# EasyEDA Pro project ProPrj_MambaQuad_2026-04-23.epro, board FC V1.1
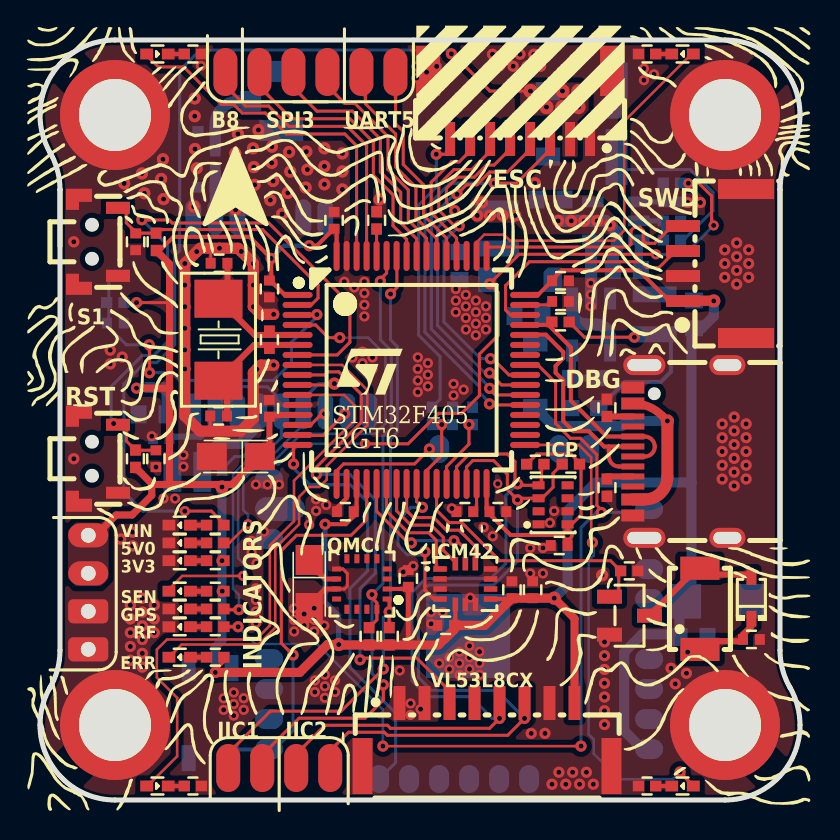
[diagram p18: board, top side]
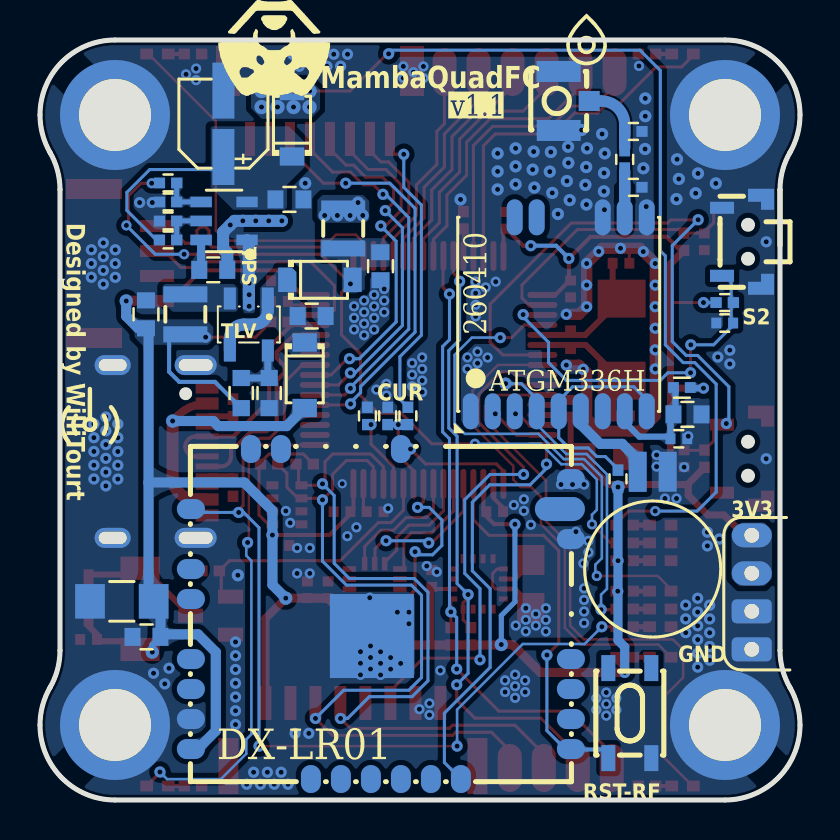
[diagram p19: board, bottom side, seen from below]

Outline 38 x 38 mm; copper layers: Top Layer, Bottom Layer. Coordinates in mm from the lower left corner of the outline.
Outline path: 1,30.52 arc(0.87,31.48) 0.5,32.38 arc(0.13,33.28) 0,34.25 arc(1.1,36.9) 3.75,38 34.25,38 arc(36.9,36.9) 38,34.25 arc(37.87,33.28) 37.5,32.38 arc(37.13,31.48) 37,30.52 37,7.48 arc(37.13,6.52) 37.5,5.62 arc(37.87,4.72) 38,3.75 arc(36.9,1.1) 34.25,0 3.75,0 arc(1.1,1.1) 0,3.75 arc(0.13,4.72) 0.5,5.62 arc(0.87,6.52) 1,7.48 1,30.52 ; 1,30.52 1,27.71
Stack: Top Layer 0.035mm / Dielectric1 1.51mm FR4 er 4.5 / Bottom Layer 0.035mm

## Design rules (mm)
net SWCLK: DP2
net SWDIO: DP2
net USB_DEBUG_DP: DP1
net USB_DEBUG_DM: DP1
spacing copperThickness1oz (default): track to track 0.102, other pairs 0.152 to 0.3
spacing copperThickness2oz: track to track 0.203, other pairs 0.152 to 0.3
spacing safeClearance1: track to track 0.152, other pairs 0.114 to 0.3
track width copperThickness1oz (default): min 0.102, default 0.203, max 2.54
track width copperThickness2oz: min 0.203, default 0.254, max 2.54
differential pair differentialPair (default): width min 0.127, default 0.254, max 2.54; gap min 0.152, default 0.152
pour e1762 uses copperRegion, safeClearance1

## Placement (name value [footprint] x y rotation side)
3V3  -  [LED0402]  6.99 11.97 0 top
5V0  -  [LED0402]  6.99 12.85 0 top
ANT  3GHz  [ANT-SMD_3P-L3.0-W2.6]  11.3 34.95 270 bottom
ATGM336H  ATGM336H-6N-74  [COMM-SMD_18P-L10.1-W9.7-P1.1-TL_L76-LB]  12.06 24.28 90 bottom
BUZ  DET402  [BUZ-SMD_L4.0-W3.0-LS4.5-FD]  33 9.56 90 top
C1  100nF  [C0402]  18.41 11.08 270 top
C2  4.7uF  [CASE-A_3216]  13.46 10.8 270 top
C3  2.2uF  [C0402]  24.63 10.51 270 top
C4  100nF  [C0402]  23.6 10.51 270 top
C5  100nF  [C0603]  32.67 8.16 180 bottom
C6  1uF  [C0402]  5.79 17.06 270 top
C7  100nF  [C0402]  14.7 28.98 270 top
C8  100nF  [C0402]  11.47 25.55 90 top
C9  100nF  [C0402]  26.03 25.96 180 top
C10  100nF  [C0402]  15.27 14.42 0 top
C11  100nF  [C0402]  22.9 14.42 180 top
C12  22pF  [C0402]  8.93 19.2 180 top
C13  22pF  [C0402]  8.95 26.84 180 top
C14  1uF  [CASE-A_3216]  9.79 17.17 180 top
C15  100nF  [C0402]  11.47 19.58 270 top
C16  2.2uF  [C0402]  26.03 24.93 180 top
C17  2.2uF  [C0402]  21.24 14.42 0 top
C18  100nF  [C0402]  25.96 12.73 0 top
C19  100uF  [C1206]  33.91 9.93 180 bottom
C21  100nF  [C0603]  25.53 30.03 0 bottom
C22  22uF  [C0603]  20.98 26.69 90 bottom
C23  100nF  [C0603]  29.34 26.51 180 bottom
C24  10uF  [CAP-SMD_BD4.0-L4.3-W4.3-LS5.0-FD]  28.83 33.81 90 bottom
C25  4.7uF  [C0603]  24.42 24.2 0 bottom
C26  10uF  [C0603]  32.7 24.28 270 bottom
C27  1uF  [C0402]  4.78 27.91 270 top
C28  1uF  [C0402]  3.76 23.85 0 bottom
C29  100nF  [C0402]  35.57 8.03 180 top
C30  10uF  [C0603]  5.63 19.28 0 bottom
C31  0.22F  [CAP-TH_DMS3R3224]  7.37 16.41 90 bottom
C32  100nF  [C0402]  6.06 18.06 0 bottom
C33  10nF  [C0402]  20.29 8.73 0 top
D1  1N5819W  [SOD-123_L2.7-W1.6-LS3.7-RD]  25.4 33.81 90 bottom
D2  1N5819W  [SOD-123_L2.7-W1.6-LS3.7-RD]  24.76 21.24 270 bottom
D3  1N5819W  [SOD-123_L2.7-W1.6-LS3.7-RD#2]  24 26.01 180 bottom
D4  1N4148WS  [SOD-323_L1.7-W1.3-LS2.5-FD]  35.57 10.11 270 top
DBG  Type-C-TOP_1  [USB-C-SMD_TYPE-C16PIN]  32 17.43 90 top
DX-LR01  DX-LR01-433T22S  [WIRELM-SMD_DX-LR01-433T22S]  20.96 9.3 270 bottom
ERR  -  [LED0402]  6.99 7.14 0 top
ESC  WAFER-SH1.0-8PWB  [CONN-SMD_8P-P1.00_XUNPU_WAFER-SH1.0-8PWB]  24 34.75 180 top
GPS  -  [LED0402]  6.99 9.55 0 top
H2  -  [HDR-TH_6P-P2.54-V-F]  15.62 36.4 0 top
H4  -  [HDR-TH_4P-P2.54-V-F]  2.41 9.42 270 top
ICM42  ICM-42688-P  [LGA-14_L3.0-W2.5-P0.50-TL]  21.27 10.8 0 top
ICP  ICP-10111  [LGA-8_L2.5-W2.0-P0.65_AMP6127]  25.65 14.76 180 top
L1  4.7uH  [IND-SMD_L2.5-W2.0_MHCHL2520]  22.84 28.58 270 bottom
L2  2.2uH  [IND-SMD_L2.5-W2.0_MHCHL2520]  30.73 24.28 270 bottom
L3  BLM15PX121SN1D  [L0402]  5.91 20.62 180 bottom
LF  -  [LED0402]  5.87 37.3 180 top
LR  -  [LED0402]  5.87 0.7 180 top
NOREF  -  [Pad_e3]  34.25 3.75 270 top
NOREF#2  -  [Pad_e2]  34.25 34.25 0 top
NOREF#3  -  [HDR-TH_4P-P2.54-V-F#2]  13.22 1.6 0 top
NOREF#4  -  [Pad_e4]  3.75 3.75 180 top
NOREF#5  -  [Pad_e1]  3.75 34.25 0 top
Q1  AO3400  [SOT-23-3_L2.9-W1.3-P1.90-LS2.4-BL-2]  29.47 9.22 270 top
QMC  QMC5883P  [LGA-16_L3.0-W3.0-P0.50-BL_SQ]  16.09 10.8 90 top
R1  4.7K  [R0402]  16.45 8.19 270 top
R5  10K  [R0402]  17.47 8.19 270 top
R6  10K  [R0402]  21.63 19.2 90 bottom
R7  5.1K  [R0402]  28.35 19.61 90 top
R8  10K  [R0402]  4.77 17.06 270 top
R9  1M  [R0402]  11.47 23.01 270 top
R10  4.7K  [R0402]  26.54 16.79 0 top
R11  4.7K  [R0402]  24.76 16.79 180 top
R12  220K  [R0402]  31.6 30.85 180 bottom
R13  30K  [R0402]  31.6 29.9 0 bottom
R14  100K  [R0603]  26.54 20.35 90 bottom
R15  4.7K  [R0402]  8.76 13.74 180 top
R16  453K  [R0603]  27.94 20.35 270 bottom
R17  1.5K  [R0402]  8.76 12.85 0 top
R18  1K  [R0402]  8.76 11.97 180 top
R19  1.5K  [R0402]  26.03 23.9 180 top
R20  UNKNOWN  [R0402]  19.6 19.2 270 bottom
R21  UNKNOWN  [R0402]  20.62 19.2 90 bottom
R22  330Ω  [R0402]  8.76 8.66 180 top
R23  200Ω  [R0402]  30.35 0.7 180 top
R24  200Ω  [R0402]  30.35 37.3 180 top
R25  330Ω  [R0402]  7.65 0.7 0 top
R26  330Ω  [R0402]  7.65 37.3 0 top
R27  330Ω  [R0402]  8.76 7.14 0 top
R28  330Ω  [R0402]  8.76 10.44 0 top
R29  10K  [R0402]  5.81 27.91 90 top
R30  10K  [R0402]  3.76 24.87 180 bottom
R31  10K  [R0402]  29.46 11.46 0 top
R32  453K  [R0402]  31.6 28 180 bottom
R33  0Ω  [R0402]  8.76 32.03 270 bottom
R34  0Ω  [R0402]  8.33 30.63 0 bottom
R35  10K  [R0402]  16.83 28.98 90 top
R36  0Ω  [R0402]  9.1 16.06 270 bottom
R37  200Ω  [R0402]  8.76 9.55 180 top
R38  5.1K  [R0402]  28.35 15.62 90 top
R39  100K  [R0402]  31.6 28.95 0 bottom
R40  0Ω  [R0402]  8.33 33.43 0 bottom
RF  -  [LED0402]  6.99 8.66 0 top
RF#2  -  [LED0402]  32.13 37.3 0 top
RR  -  [LED0402]  32.13 0.7 0 top
RST  HX TS24CA-H3.8 160gf  [SW-SMD_TS24CA]  2.92 17.06 90 top
RST-RF  K2-1808SN-A3SW-01  [SW-SMD_4P-L4.2-W3.3-P2.15-LS5.1]  8.51 4.34 270 bottom
S1  HX TS24CA-H3.8 160gf  [SW-SMD_TS24CA]  2.92 27.91 90 top
S2  HX TS24CA-H3.8 160gf  [SW-SMD_TS24CA]  2.92 27.91 270 bottom
SEN  -  [LED0402]  6.99 10.44 0 top
STM32F405  STM32F405RGT6  [LQFP-64_L10.0-W10.0-P0.50-LS12.0-BL]  18.57 21.5 270 top
SWD  WAFER-GH1.25-4PWB  [CONN-SMD_4P-P1.25_XUNPU_WAFER-GH1.25-4PWB]  33.73 26.82 90 top
TLV  TLV62568DBVR  [SOT-23-5_L3.0-W1.7-P0.95-LS2.8-BR]  27.56 23.78 90 bottom
TPS  TPS54202DDCR  [SOT-23-6_L2.9-W1.6-P0.95-LS2.8-BL]  28.8 28.95 90 bottom
VIN  -  [LED0402]  6.99 13.74 0 top
VL53L8CX  WAFER-GH1.25-8PWB  [CONN-SMD_8P-P1.25_XUNPU-WAFER-GH1.25-8PWB]  22.35 3.27 0 top
X1  8MHz  [CRYSTAL-SMD_L5.0-W3.2]  8.92 23.01 90 top

## Footprints (pads in the part's own frame, mm; a bottom-side part is the same pattern mirrored in y, then rotated)
ANT-SMD_3P-L3.0-W2.6
  rect 1x1.05 smd: 1(0,0.762)
  rect 1.05x2.2 smd: 2(-1.475,-0.762) 3(1.475,-0.762)
BUZ-SMD_L4.0-W3.0-LS4.5-FD
  rect 1.16x1.96 smd: 1(-2.03,0) 2(2.03,0)
C0402
  rect 0.5x0.54 smd: 1(-0.42,0) 2(0.42,0)
C0603
  rect 0.8x0.9 smd: 1(-0.7,0) 2(0.7,0)
C1206
  rect 1.485x1.728 smd: 1(-1.593,0) 2(1.593,0)
CAP-SMD_BD4.0-L4.3-W4.3-LS5.0-FD
  rect 2.8x1.1 smd: 1(-1.661,0) 2(1.661,0)
CAP-TH_DMS3R3224
  rect 2x0.9 smd: 1(-0.002,0.75) 2(0.002,-0.75)
CASE-A_3216
  rect 1.5x1.359 smd: 1(-1.2,0) 2(1.2,0)
COMM-SMD_18P-L10.1-W9.7-P1.1-TL_L76-LB
  custom 1.8x0.8 smd: 1(-4.85,4.4) 2(-4.85,3.3) 3(-4.85,2.2) 4(-4.85,1.1) 5(-4.85,0) 6(-4.85,-1.1) 7(-4.85,-2.2) 8(-4.85,-3.3) 9(-4.85,-4.4) 10(4.85,-4.4) 11(4.85,-3.3) 12(4.85,-2.2) 15(4.85,1.1) 16(4.85,2.2)
CONN-SMD_4P-P1.25_XUNPU_WAFER-GH1.25-4PWB
  rect 0.6x1.7 smd: 1(-1.875,1.575) 2(-0.625,1.575) 3(0.625,1.575) 4(1.875,1.575)
  rect 1x2.8 smd: 5(3.725,-1.575) 6(-3.725,-1.575)
CONN-SMD_8P-P1.00_XUNPU_WAFER-SH1.0-8PWB
  rect 0.5x1.7 smd: 1(-3.5,1.7) 2(-2.5,1.7) 3(-1.5,1.7) 4(-0.5,1.7) 5(0.5,1.7) 6(1.5,1.7) 7(2.5,1.7) 8(3.5,1.7)
  rect 1.2x2.5 smd: 9(4.6,-1.7) 10(-4.6,-1.7)
CONN-SMD_8P-P1.25_XUNPU-WAFER-GH1.25-8PWB
  rect 0.6x1.7 smd: 1(-4.375,1.575) 2(-3.126,1.575) 3(-1.875,1.575) 4(-0.625,1.575) 5(0.625,1.575) 6(1.875,1.575) 7(3.125,1.575) 8(4.375,1.575)
  rect 1x2.8 smd: 10(6.225,-1.575) 11(-6.225,-1.575)
CRYSTAL-SMD_L5.0-W3.2
  rect 1.9x2.4 smd: 1(-2.05,0) 2(2.05,0)
HDR-TH_4P-P2.54-V-F
  oval 1.2x2 hole 0.74: 1(-3.81,0) 2(-1.91,0)
  rrect 1.2x2 hole 0.74: 3(-0.01,0) 4(1.89,0)
HDR-TH_4P-P2.54-V-F#2
  oval 1.2x2.4 smd: 1(-3.81,0) 2(-2.11,0) 3(-0.41,0) 4(1.29,0)
HDR-TH_6P-P2.54-V-F
  oval 1.2x2.4 smd: 1(-6.35,0) 2(-4.65,0) 3(-2.95,0) 4(-1.25,0) 5(0.45,0) 6(2.15,0)
IND-SMD_L2.5-W2.0_MHCHL2520
  rect 0.8x2.2 smd: 1(-1,0) 2(1,0)
L0402
  rect 0.54x0.54 smd: 1(-0.42,0) 2(0.42,0)
LED0402
  rect 0.637x0.541 smd: 1(-0.538,0) 2(0.538,0)
LGA-8_L2.5-W2.0-P0.65_AMP6127
  rect 0.6x0.4 smd: 1(0.725,0.975) 2(0.725,0.325) 3(0.725,-0.325) 4(0.725,-0.975) 5(-0.725,-0.975) 6(-0.725,-0.325) 7(-0.725,0.325) 8(-0.725,0.975)
LGA-14_L3.0-W2.5-P0.50-TL
  rect 0.675x0.28 smd: 1(-1.262,0.75) 2(-1.262,0.25) 3(-1.262,-0.25) 4(-1.262,-0.75) 8(1.262,-0.75) 9(1.262,-0.25) 10(1.262,0.25) 11(1.262,0.75)
  rect 0.28x0.675 smd: 5(-0.5,-1.012) 6(0,-1.012) 7(0.5,-1.012) 12(0.5,1.012) 13(0,1.012) 14(-0.5,1.012)
LGA-16_L3.0-W3.0-P0.50-BL_SQ
  rect 0.25x0.45 smd: 1(-0.75,-1.263) 2(-0.25,-1.263) 3(0.25,-1.263) 4(0.75,-1.263) 9(0.75,1.263) 10(0.25,1.263) 11(-0.25,1.263) 12(-0.75,1.263)
  rect 0.45x0.25 smd: 5(1.263,-0.75) 6(1.263,-0.25) 7(1.263,0.25) 8(1.263,0.75) 13(-1.263,0.75) 14(-1.263,0.25) 15(-1.263,-0.25) 16(-1.263,-0.75)
LQFP-64_L10.0-W10.0-P0.50-LS12.0-BL
  oval 0.3x1.5 smd: 1(-3.75,-5.688) 2(-3.25,-5.688) 3(-2.75,-5.688) 4(-2.25,-5.688) 5(-1.75,-5.688) 6(-1.25,-5.688) 7(-0.75,-5.688) 8(-0.25,-5.688) 9(0.25,-5.688) 10(0.75,-5.688) 11(1.25,-5.688) 12(1.75,-5.688) 13(2.25,-5.688) 14(2.75,-5.688) 15(3.25,-5.688) 16(3.75,-5.688) 33(3.75,5.688) 34(3.25,5.688) 35(2.75,5.688) 36(2.25,5.688) 37(1.75,5.688) 38(1.25,5.688) 39(0.75,5.688) 40(0.25,5.688) 41(-0.25,5.688) 42(-0.75,5.688) 43(-1.25,5.688) 44(-1.75,5.688) 45(-2.25,5.688) 46(-2.75,5.688) 47(-3.25,5.688) 48(-3.75,5.688)
  oval 1.5x0.3 smd: 17(5.7,-3.738) 18(5.7,-3.238) 19(5.7,-2.738) 20(5.7,-2.238) 21(5.7,-1.738) 22(5.7,-1.238) 23(5.7,-0.739) 24(5.7,-0.238) 25(5.7,0.262) 26(5.7,0.762) 27(5.7,1.262) 28(5.7,1.762) 29(5.7,2.261) 30(5.7,2.762) 31(5.7,3.261) 32(5.7,3.762) 49(-5.7,3.762) 50(-5.7,3.261) 51(-5.7,2.762) 52(-5.7,2.261) 53(-5.7,1.762) 54(-5.7,1.262) 55(-5.7,0.762) 56(-5.7,0.262) 57(-5.7,-0.238) 58(-5.7,-0.739) 59(-5.7,-1.238) 60(-5.7,-1.738) 61(-5.7,-2.238) 62(-5.7,-2.738) 63(-5.7,-3.238) 64(-5.7,-3.738)
Pad_e1
  round 5.5 hole 3.6: 1(0,0)
Pad_e2
  round 5.5 hole 3.6: 1(0,0)
Pad_e3
  round 5.5 hole 3.6: 1(0,0)
Pad_e4
  round 5.5 hole 3.6: 1(0,0)
R0402
  rect 0.566x0.54 smd: 1(-0.433,0) 2(0.433,0)
R0603
  rect 0.806x0.864 smd: 1(-0.753,0) 2(0.753,0)
SOD-123_L2.7-W1.6-LS3.7-RD
  rect 0.91x1.22 smd: 1(-1.635,0) 2(1.635,0)
SOD-123_L2.7-W1.6-LS3.7-RD#2
  custom 0.91x1.22 smd: 1(-1.635,0)
  rect 0.91x1.22 smd: 2(1.635,0)
SOD-323_L1.7-W1.3-LS2.5-FD
  rect 0.78x0.5 smd: 1(-1.04,0) 2(1.04,0)
SOT-23-3_L2.9-W1.3-P1.90-LS2.4-BL-2
  rect 0.7x1.25 smd: 1(-0.95,-1) 2(0.95,-1) 3(0,1)
SOT-23-5_L3.0-W1.7-P0.95-LS2.8-BR
  rect 1.1x0.6 smd: 1(1.3,-0.95) 2(1.3,0) 3(1.3,0.95) 4(-1.3,0.95) 5(-1.3,-0.95)
SOT-23-6_L2.9-W1.6-P0.95-LS2.8-BL
  rect 0.532x1.072 smd: 1(-0.95,-1.149) 2(0,-1.149) 3(0.95,-1.149) 4(0.95,1.149) 5(0,1.149) 6(-0.95,1.149)
SW-SMD_4P-L4.2-W3.3-P2.15-LS5.1
  rect 1.3x0.7 smd: 1(-2.25,1.075) 2(2.25,1.075) 3(-2.25,-1.075) 4(2.25,-1.075)
SW-SMD_TS24CA
  custom 1.05x1.3 smd: 1(-2.125,0.975) 2(2.125,0.975)
  rect 0.6x1.2 smd: 3(-1.7,-0.975) 4(1.7,-0.975)
USB-C-SMD_TYPE-C16PIN
  oval 1x2.1 hole 0.6x1.7: 1(-4.32,1.788) 2(4.32,1.788)
  oval 1x1.8 hole 0.6x1.4: 3(-4.32,-2.362) 4(4.32,-2.362)
  rect 0.6x1.15 smd: A1B12(-3.2,2.362) A4B9(-2.4,2.362) B1A12(3.2,2.362) B4A9(2.4,2.362)
  rect 0.3x1.15 smd: A5(-1.25,2.362) A6(-0.25,2.362) A7(0.25,2.362) A8(1.25,2.362) B5(1.75,2.362) B6(0.75,2.362) B7(-0.75,2.362) B8(-1.75,2.362)
WIRELM-SMD_DX-LR01-433T22S
  oval 1.4x1 smd: 2(-8.25,1) 6(-8.25,-5) 7(-8.25,-6.5) 16(8.25,-3.5) 17(8.25,-2) 18(8.25,-0.5) 19(8.25,1) 20(8.25,2.5) 21(8.25,4)
  oval 1x1.4 smd: 8(-5.25,-9.5) 10(-2.25,-9.5) 11(-0.75,-9.5) 12(2.25,-9.5) 13(3.75,-9.5) 14(5.25,-9.5) 15(6.75,-9.5) 22(6.75,9.5) 23(5.25,9.5) 24(3.75,9.5) 25(2.25,9.5) 28(-3.75,9.5) 30(-6.75,9.5)
  oval 1.2x2.5 smd: 29(-5.25,8.95)
  rect 4.2x4.2 smd: 31(1.1,-0.45)

## Nets
3V3: BUZ.1 C1.2 C3.2 C4.2 C5.2 C7.2 C8.2 C9.2 C10.2 C11.2 C14.1 C15.2 C18.2 C19.2 C26.2 C29.2 C33.2 D4.2 DX-LR01.15 H4.1 H4.2 ICM42.5 ICM42.8 ICP.8 L2.2 L3.2 QMC.2 R1.2 R5.2 R8.2 R10.2 R11.2 R16.2 R18.1 R19.1 R27.2 R28.2 R29.1 R30.1 R36.2 STM32F405.1 STM32F405.13 STM32F405.19 STM32F405.32 STM32F405.48 STM32F405.64 SWD.1 VL53L8CX.8
5V_TPS: C22.2 D3.2 L1.2 R12.1 R17.2
5V_USB: D2.2 DBG.A4B9 DBG.B4A9
GND: 3V3.1 5V0.1 ANT.2 ANT.3 ATGM336H.1 ATGM336H.10 ATGM336H.12 C1.1 C2.2 C3.1 C4.1 C5.1 C6.2 C7.1 C8.1 C9.1 C10.1 C11.1 C12.2 C13.2 C14.2 C15.1 C16.1 C17.1 C18.1 C19.1 C21.1 C22.1 C24.2 C25.1 C26.1 C27.2 C28.2 C29.1 C30.1 C31.2 C32.1 C33.1 DBG.1 DBG.2 DBG.3 DBG.4 DBG.A1B12 DBG.B1A12 DX-LR01.14 DX-LR01.28 DX-LR01.30 DX-LR01.31 ESC.1 ESC.9 ESC.10 GPS.1 H4.3 H4.4 ICM42.2 ICM42.3 ICM42.6 ICM42.7 ICM42.10 ICM42.11 ICP.1 ICP.7 NOREF.1 NOREF#2.1 NOREF#4.1 NOREF#5.1 Q1.2 QMC.9 QMC.11 R6.2 R7.2 R13.2 R14.1 R21.2 R23.2 R24.2 R25.2 R26.2 R31.2 R34.1 R35.2 R38.1 R39.2 R40.1 RF.1 RST.1 RST.2 RST.3 RST-RF.2 S1.1 S1.2 S1.3 S2.1 S2.2 S2.3 STM32F405.12 STM32F405.18 STM32F405.63 SWD.2 SWD.5 SWD.6 TLV.2 TPS.1 VIN.1 VL53L8CX.1 VL53L8CX.2 VL53L8CX.7 VL53L8CX.10 VL53L8CX.11
VIN: D1.2 ESC.2 R15.1
ADC1_IN8: R20.2 R21.1 STM32F405.26
BUZ: Q1.1 R31.1 STM32F405.27
DSHOT_M1: ESC.3 STM32F405.37
DSHOT_M2: ESC.4 STM32F405.38
DSHOT_M3: ESC.5 STM32F405.39
DSHOT_M4: ESC.6 STM32F405.40
ESC_CURR: ESC.8 R20.1
ESC_TX: ESC.7 STM32F405.52
EX_PB8: H2.1 STM32F405.61
EX_SPI3_MISO: H2.3 STM32F405.56
EX_SPI3_MOSI: H2.2 STM32F405.57
EX_SPI3_SCK: H2.4 STM32F405.55
EX_UART5_RX: H2.5 STM32F405.54
EX_UART5_TX: H2.6 STM32F405.53
GPIO_EXTI2: ATGM336H.4 R37.1 STM32F405.10
GPIO_EXTI5: ICM42.4 STM32F405.25
GPIO_EXTI8: DX-LR01.8 R22.1 STM32F405.41
GPIO_EXTI13: C27.1 R29.2 S1.4 STM32F405.2
GPIO_EXTI14: C28.1 R30.2 S2.4 STM32F405.3
GPS_RX: ATGM336H.3 STM32F405.14
GPS_TX: ATGM336H.2 STM32F405.15
I2C1_SCL: NOREF#3.1 QMC.1 R5.1 STM32F405.58
I2C1_SDA: NOREF#3.2 QMC.16 R1.1 STM32F405.59
I2C2_SCL: ICP.4 NOREF#3.3 R11.1 STM32F405.29 VL53L8CX.5
I2C2_SDA: ICP.3 NOREF#3.4 R10.1 STM32F405.30 VL53L8CX.6
ICM42688P_CS: ICM42.12 STM32F405.24
ICM42688P_SCK: ICM42.13 STM32F405.21
ICM42688P_SDI: ICM42.14 STM32F405.23
ICM42688P_SDO: ICM42.1 STM32F405.22
LED_ERR: ERR.1 STM32F405.8
LED_LF: LF.2 STM32F405.62
LED_LR: LR.2 STM32F405.11
LED_RF: RF#2.2 STM32F405.50
LED_RR: RR.2 STM32F405.33
LED_SENS: SEN.1 STM32F405.4
LORA_RST: DX-LR01.22 RST-RF.4 STM32F405.20
LORA_RX: DX-LR01.21 STM32F405.16
LORA_TX: DX-LR01.2 STM32F405.17
OSC_IN: C13.1 R9.1 STM32F405.5 X1.2
OSC_OUT: C12.1 R9.2 STM32F405.6 X1.1
PC1: STM32F405.9 VL53L8CX.3
RST: C6.1 R8.1 RST.4 STM32F405.7
SPI2_MISO: STM32F405.35
SPI2_MOSI: STM32F405.36
SPI2_SCK: STM32F405.34
SWCLK: STM32F405.49 SWD.4
SWDIO: STM32F405.46 SWD.3
TPS_EN: R32.2 R39.1 TPS.5
TPS_VIN: C21.2 C24.1 D1.1 R32.1 TPS.3
USART1_RX: STM32F405.43
USART1_TX: STM32F405.42
USART3_TX: STM32F405.51
USB_DEBUG_DM: DBG.A7 DBG.B7 STM32F405.44
USB_DEBUG_DP: DBG.A6 DBG.B6 R19.2 STM32F405.45
$1N19: C2.1 QMC.10
$1N83: C16.2 STM32F405.47
$1N84: C17.2 STM32F405.31
$1N102: R6.1 STM32F405.28
$1N103: R35.1 STM32F405.60
$1N118: R12.2 R13.1 TPS.4
$1N121: C23.1 TPS.6
$1N122: C23.2 L1.1 TPS.2
$1N125: R15.2 VIN.2
$1N127: R14.2 R16.1 TLV.5
$1N129: L2.1 TLV.3
$1N138: 5V0.2 R17.1
$1N141: 3V3.2 R18.2
$1N278: C25.2 D2.1 D3.1 TLV.1 TLV.4
$1N282: DBG.A5 R38.2
$1N283: DBG.B5 R7.1
$1N318: R22.2 RF.2
$1N356: BUZ.2 D4.1 Q1.3
$1N367: GPS.2 R37.2
$1N378: ATGM336H.6 C31.1
$1N384: ATGM336H.11 R33.2 R34.2
$1N390: ATGM336H.5 ATGM336H.9 R36.1
$1N391: ATGM336H.8 C30.2 C32.2 L3.1
$1N397: ANT.1 R33.1 R40.2
$1N445: R28.1 SEN.2
$1N446: ERR.2 R27.1
$1N450: LF.1 R26.1
$1N451: LR.1 R25.1
$1N452: R24.1 RF#2.1
$1N453: R23.1 RR.1

Pads without a net: ATGM336H 7 15 16; DBG A8 B8; DX-LR01 6 7 10 11 12 13 16 17 18 19 20 23 24 25 29; ICM42 9; ICP 2 5 6; QMC 3 4 5 6 7 8 12 13 14 15; RST-RF 1 3; VL53L8CX 4

## Via types
v1: diameter 0.559, hole 0.254, Top Layer to Bottom Layer, 149 vias
v2: diameter 0.66, hole 0.254, Top Layer to Bottom Layer, 6 vias
v3: diameter 0.61, hole 0.254, Top Layer to Bottom Layer, 53 vias
v4: diameter 0.508, hole 0.254, Top Layer to Bottom Layer, 129 vias
v5: diameter 0.457, hole 0.254, Top Layer to Bottom Layer, 1 via
v6: diameter 0.711, hole 0.254, Top Layer to Bottom Layer, 8 vias

## Routing (per net, layer and track width the routed paths; a pad name or vN(x,y) marks a point on that pad's centre or on a via; arc(x,y) is an arc through that point)
3V3: length 174.2
  Top Layer w0.152: v1(4.83,24.87) 6.47,24.87 6.48,24.86 ; v1(8.76,6.38) 8.76,6.49 9.2,6.92 R27.2 ; R19.1 27.22,23.14 v1(29.72,23.14) ; R11.2 24.69,17.15 24.69,17.16 24.83,17.3 26.54,17.3 26.98,16.87 R10.2 27.05,16.72 27.05,14.25 26.59,13.78 ICP.8
  Top Layer w0.196: C9.2 24.95,25.31 24.69,25.31 24.64,25.25 STM32F405.48
  Top Layer w0.203: v3(26.38,13.25) C18.2 ; v3(26.38,13.25) ICP.8 ; v3(26.38,13.25) 26.37,13.25 23.53,13.25 22.48,14.3 C11.2 ; STM32F405.64 14.83,28.56 14.69,28.56 13.84,27.71 v1(13.46,27.71) ; R29.1 5.99,27.48 6.67,28.16 10.48,28.16 v1(11.56,27.08) 11.56,26.06 C8.2 11.52,25.97 12.24,25.25 STM32F405.1 ; C33.2 20.77,8.79 ICM42.5 ; C1.2 18.31,10.55 QMC.2 ; SWD.1 31.47,24.95 29.93,26.48 26.08,26.48 25.61,26.01 C9.2 ; ICM42.8 23.56,10.05 ; STM32F405.19 15.83,14.56 C10.2 15.69,14.19 15.29,13.79 14.26,13.79 v1(14.25,13.79) ; STM32F405.32 22.33,14.57 22.48,14.42
  Top Layer w0.254: C1.2 18.41,7.75
  Top Layer w0.299: C14.1 11.47,17.65 C15.2 11.56,19.25 STM32F405.13
  Top Layer w0.305: D4.2 35.57,8.69 35.15,8.27 C29.2 35.06,7.94 33.41,7.94 BUZ.1
  Top Layer w0.355: 4.77,16.63 5.63,15.78 ; 5.63,15.78 6.48,15.78 ; 5.63,15.78 5.59,15.74 5.59,15.23 4.61,14.25 3.81,14.25 2.79,13.23 H4.1 ; 6.48,15.78 9.12,15.78 ; 6.48,15.78 6.48,20.6 ; 9.12,15.78 9.59,15.78 C14.1 ; 9.12,15.78 9.1,15.76 v2(9.1,15.65) ; R29.1 6.48,26.81 6.48,20.6 ; v1(4.83,20.59) 6.47,20.59 6.48,20.6
  Top Layer w0.406: v2(25.71,10.09) 26.73,9.08 VL53L8CX.8
  Top Layer w0.457: v1(8.76,6.38) 12.98,6.38 14.38,7.77 v2(14.94,7.77) 14.96,7.75 R1.2 R5.2 19.92,7.75 20.25,8.08 20.27,8.08 20.71,8.52 C33.2 22.24,8.73 C4.2 C3.2 v2(25.71,10.09)
  Top Layer w0.508: v2(33.69,24.95) 33.68,24.96 32.16,24.96 SWD.1
  Bottom Layer w0.152: R30.1 v1(4.83,24.87)
  Bottom Layer w0.203: v1(11.56,27.08) 12.19,27.71 v1(13.46,27.71) ; 31.54,23.28 31.54,21.41 31.04,20.91 29.25,20.91 R16.2
  Bottom Layer w0.254: v2(14.94,7.77) 14.94,9.22 14.25,9.9 v1(14.25,13.79)
  Bottom Layer w0.305: C5.2 32.38,7.74 v2(32.38,7.39) ; 5.33,20.59 v1(4.83,20.59)
  Bottom Layer w0.406: 31.54,23.28 30.61,23.28 ; 30.28,2.55 DX-LR01.15
  Bottom Layer w0.457: v2(9.1,15.65) 9.1,7.98 8.76,7.65 v1(8.76,6.38)
  Bottom Layer w0.508: v2(25.71,10.09) 26.38,10.76 v3(26.38,13.25) 26.38,14.47 27.79,15.88 32.57,15.88 ; 32.57,15.88 32.57,23.58 33.08,23.58 33.69,24.19 v2(33.69,24.95) ; 32.57,15.88 32.57,10.19 C19.2 31.97,9.59 C5.2 31.85,8.28 30.1,8.28 29.21,7.39 29.21,3.46 30.12,2.55 30.28,2.55
  vias: v1(9.1,11.97) v1(9.11,10.44)
5V_TPS: length 39.4
  Top Layer w0.127: R17.2 9.47,12.85 v4(10.4,13.79)
  Top Layer w0.152: v4(33.68,28.73) 33.58,28.83 33.58,30.2 32.94,30.84 v4(32.42,30.84) ; v4(30.79,27.29) 23.96,27.29 v1(22.48,25.81) 22.92,25.36 22.92,23.25 21.97,22.3 21.97,20.22 21.08,19.33 19.93,19.33 18.41,17.81 v4(16.26,17.81)
  Bottom Layer w0.127: v4(10.4,13.79) 10.4,14.26 10.16,14.5 10.16,16.03 10.92,16.79 11.94,16.79 12.96,17.81 v4(16.26,17.81)
  Bottom Layer w0.152: v4(32.42,30.84) 32.4,30.85 R12.1 ; v4(30.79,27.29) 32.24,27.29 v4(33.68,28.73)
5V_USB: length 14.3
  Top Layer w0.406: v2(31.37,18.95) 31.09,19.22 arc(30.43,19.67) DBG.B4A9
  Top Layer w0.6: v2(31.37,18.95) 31.37,16.16 arc(31.04,15.36) 30.24,15.03 DBG.A4B9
  Bottom Layer w0.508: D2.2 25.67,18.7 29.08,18.7 29.34,18.95 v2(31.37,18.95)
GND: length 32.3
  Top Layer w0.152: QMC.9 15.15,11.55 15.37,11.33 15.37,10.69 15.22,10.55 QMC.11 ; C12.2 8.51,18.44 ; C13.2 8.53,27.58 8.54,27.59
  Top Layer w0.203: STM32F405.18 15.33,15.1 14.85,14.62 C10.1
  Top Layer w0.249: QMC.11 14.25,10.55 13.46,9.76 C2.2
  Top Layer w0.559: v1(11.68,24.28) 11.05,24.28 v1(10.67,24.67) v1(10.67,25.74) v1(10.67,26.82) 9.91,27.59 v1(8.98,27.59) 8,27.59 v1(7.24,26.82) v1(7.24,25.74) v1(7.24,24.67) v1(7.24,23.59) v1(7.24,22.51) v1(7.24,21.55) 7.24,19.2 8,18.44 10.03,18.44 10.67,19.08 10.67,21.36 11.05,21.74 v1(11.68,21.74)
  Bottom Layer w0.6: TLV.2 27.56,27.91 TPS.1
  vias: v1(1.69,27.91) v1(1.69,17.06) v1(3.51,22.49) v1(3.51,21.8) v1(4.03,13.05) v1(4.11,22.15) v1(4.52,9.74) v1(4.52,9.05) v1(4.52,8.36) v1(4.52,7.68) v1(4.52,6.99) v1(4.63,13.39) v1(4.63,12.7) v1(5.12,10.09) v1(5.12,9.4) v1(5.12,8.71) v1(5.12,8.02) v1(5.12,7.33) v1(5.12,6.64) v1(5.72,9.74) v1(5.72,9.06) v1(5.72,8.37) v1(7.84,27.42) v1(10.06,27.43) v1(10.84,21.54) v1(22.62,37.29) v1(22.97,36.69) v1(23.31,37.29) v1(23.66,36.69) v1(24,37.29) v1(24.35,36.69) v1(24.56,3.33) v1(24.69,37.29) v1(25.03,36.69) v1(25.25,3.33) v1(25.38,37.29) v1(25.6,0.79) v1(25.94,1.39) v1(26.29,0.79) v1(26.63,1.39) v1(26.98,0.79) v1(27.32,1.39) v1(27.67,0.79) v1(28.22,7.9) v1(28.22,7.21) v1(28.22,6.53) v1(28.22,5.84) v1(28.22,5.15) v1(28.22,4.46) v1(28.22,3.77) v1(31.55,6.59) v1(31.76,5.81) v1(32.32,6.34) v1(32.38,29.87) v1(33.02,29.87) v1(34.11,18.8) v1(34.11,18.11) v1(34.11,17.42) v1(34.11,16.74) v1(34.11,16.05) v1(34.24,27.51) v1(34.24,26.82) v1(34.24,26.13) v1(34.71,19.15) v1(34.71,18.46) v1(34.71,17.77) v1(34.71,17.08) v1(34.71,16.39) v1(34.71,15.7) v1(34.83,27.86) v1(34.83,27.17) v1(34.83,26.48) v1(34.83,25.79) v1(35.31,18.8) v1(35.31,18.12) v1(35.31,17.43) v1(35.31,16.74) v1(35.31,16.05) v1(35.43,27.51) v1(35.43,26.82) v1(35.43,26.14) v3(4.21,30.83) v3(5.1,31.33) v3(5.22,30.34) v3(6.15,32.04) v3(6.06,31.05) v3(6.18,30.04) v3(7.74,35.08) v3(7.74,34.19) v3(7.75,32.55) v3(7.69,29.67) v3(7.83,31.59) v3(9.76,32.33) v3(9.8,31.35) v3(9.8,30.43) v3(9.78,29.51) v3(9.9,33.3) v3(10.65,32.58) v3(10.69,31.65) v3(10.73,30.76) v3(10.68,29.77) v3(10.92,33.5) v3(11.52,29.99) v3(11.59,32.67) v3(11.58,31.86) v3(11.66,30.95) v3(12.11,29.3) v3(12.39,30.35) v3(12.46,32.4) v3(12.51,31.42) v3(13.32,32.42) v3(13.28,30.62) v3(13.37,31.52) v3(14.22,32.58) v3(14.22,31.68) v3(14.22,30.78) v3(15.12,32.33) v3(15.12,31.43) v3(15.12,30.53) v3(16.97,30.03) v3(24.74,30.84) v3(28.11,11.24) v4(5.59,18.19) v4(5.79,16.64) v4(6.17,15.08) v4(6.75,15.08) v4(7.17,17.25) v4(7.17,16.67) v4(8.05,36.7) v4(9.18,5.08) v4(9.18,4.51) v4(9.69,5.38) v4(9.69,4.8) v4(9.69,4.22) v4(10.19,5.09) v4(10.19,4.51) v4(10.58,12.96) v4(10.58,12.38) v4(10.79,15.78) v4(10.83,11.83) v4(10.79,10.58) v4(10.79,10) v4(10.79,9.42) v4(10.79,8.85) v4(11.2,13.42) v4(11.37,15.78) v4(11.95,15.78) v4(12.71,9.59) v4(12.71,9.01) v4(12.71,8.43) v4(13.21,9.3) v4(13.21,8.72) v4(13.46,13.76) v4(13.71,9.59) v4(13.71,9.01) v4(13.71,8.43) v4(13.74,5.98) v4(13.74,5.4) v4(13.81,15.04) v4(13.81,14.46) v4(14.21,8.72) v4(14.24,6.27) v4(14.24,5.69) v4(14.24,5.11) v4(14.31,14.75) v4(14.75,5.98) v4(14.75,5.4) v4(15.22,25.92) v4(15.62,22.12) v4(15.72,25.63) v4(16.12,22.42) v4(16.12,21.84) v4(16.22,25.92) v4(16.22,25.34) v4(16.22,24.76) v4(16.22,24.18) v4(16.63,22.13) v4(16.63,21.55) v4(17.98,6.48) v4(18.16,11.41) v4(18.53,4.83) v4(18.53,4.25) v4(18.66,11.7) v4(18.83,36.68) v4(18.83,36.1) v4(18.89,22.13) v4(18.89,21.55) v4(18.89,20.97) v4(18.89,20.39) v4(19.03,4.54) v4(19.33,36.39) v4(19.39,21.84) v4(19.39,21.26) v4(19.39,20.69) v4(19.55,9.39) v4(19.55,8.81) v4(19.83,36.68) v4(19.83,36.1) v4(19.97,6.83) v4(20.13,9.39) v4(20.47,7.12) v4(20.47,6.54) v4(20.59,14.58) v4(20.68,20.81) v4(20.68,20.23) v4(20.79,25.55) v4(20.79,24.97) v4(20.79,24.39) v4(20.97,7.41) v4(20.97,6.83) v4(20.97,6.25) v4(21.18,20.52) v4(21.29,25.26) v4(21.29,24.68) v4(21.29,24.1) v4(21.29,23.52) v4(21.51,10.11) v4(21.47,7.7) v4(21.47,7.12) v4(21.47,6.55) v4(21.79,24.97) v4(21.79,24.39) v4(21.79,23.81) v4(21.79,23.24) v4(21.98,7.42) v4(21.98,6.84) v4(21.98,6.26) v4(22.18,13.63) v4(22.3,24.69) v4(22.3,24.11) v4(22.3,23.53) v4(22.63,13.19) v4(24.51,12.6) v4(24.51,11.33) v4(25.15,12.6) v4(25.15,11.33) v4(25.49,13.86) v4(25.71,14.45) v4(27.54,25.84) v4(27.54,25.26) v4(27.54,24.69) v4(30.2,36.57) v4(30.2,35.99) v4(30.7,36.28) v5(22.89,15.81)
VIN: length 47.1
  Top Layer w0.152: 20.58,37.37 22.5,35.45 v6(24.52,35.45) ; v4(7.24,14.44) 8.57,14.44 9.2,13.82 R15.1
  Bottom Layer w0.152: 20.58,37.37 20.45,37.49 8,37.49 6.99,36.48 6.99,27.46 6.73,27.21 6.73,22.76 5.84,21.87 5.26,21.87 4.19,20.8 4.19,15.39 5.14,14.44 v4(7.24,14.44)
  vias: v1(20.57,37.31) v6(24.52,34.65) v6(25.32,35.45) v6(25.32,34.65) v6(26.12,35.45) v6(26.12,34.65) v6(26.92,35.45) v6(26.92,34.65)
ADC1_IN8: length 3.8
  Top Layer w0.152: STM32F405.26 19.33,16.47 20.08,17.23 v1(20.08,18.77)
  Bottom Layer w0.541: v1(20.08,18.77) 19.6,18.77
BUZ: length 13.4
  Top Layer w0.152: 28.97,11.52 28.94,11.49 28.94,10.42 28.81,10.29 28.47,10.29 ; 28.97,11.52 R31.1 ; 28.97,11.52 28.52,11.97 22.99,11.97 21.08,13.87 20.45,13.87 19.83,14.49 STM32F405.27
DSHOT_M1: length 20.9
  Top Layer w0.152: ESC.3 25.5,32.52 23.83,30.84 v1(22.72,30.84) ; STM32F405.37 22.52,19.75 v1(22.47,19.8)
  Bottom Layer w0.152: v1(22.72,30.84) 20.51,30.84 19.25,29.58 19.25,23.39 21.97,20.67 21.97,20.37 22.47,19.87 v1(22.47,19.8)
DSHOT_M2: length 18.6
  Top Layer w0.152: 22.5,20.61 22.5,20.53 22.77,20.25 STM32F405.38 ; v1(20.85,30.28) 21.33,30.76 21.84,30.76 22.48,31.4 23.37,31.4 24.5,32.53 ESC.4
  Bottom Layer w0.152: v1(20.85,30.28) 20.71,30.28 20,29.57 20,29.56 19.56,29.12 19.56,23.55 22.5,20.61
  vias: v1(22.48,20.58)
DSHOT_M3: length 17.5
  Top Layer w0.152: ESC.5 23.5,32.55 22.7,31.74 22.32,31.74 21.72,31.14 20.88,31.14 20.32,30.58 20.32,29.89 v1(20.74,29.47) ; STM32F405.39 23.07,20.75 22.48,21.35 v1(22.48,21.35)
  Bottom Layer w0.152: v1(22.48,21.35) 22.25,21.35 19.88,23.72 19.88,28.61 v1(20.74,29.47)
DSHOT_M4: length 16.8
  Top Layer w0.152: STM32F405.40 23.45,21.25 22.64,22.06 v1(22.53,22.06) ; v1(20.96,28.7) 20.73,28.7 19.94,29.49 19.94,30.76 20.7,31.52 21.59,31.52 22.5,32.44 ESC.6
  Bottom Layer w0.152: v1(22.53,22.06) 22.03,22.06 20.19,23.9 20.19,27.94 v1(20.96,28.7)
ESC_CURR: length 15
  Top Layer w0.152: v1(19.81,32.28) 20.32,32.28 20.5,32.47 ESC.8
  Bottom Layer w0.152: R20.1 20,20.04 20,22.17 18.93,23.24 18.93,29.75 19.81,30.63 v1(19.81,32.28)
ESC_TX: length 7.4
  Top Layer w0.152: ESC.7 21.5,32.45 20.96,31.9 20.57,31.9 19.56,30.89 19.56,29.36 20.83,28.09 STM32F405.52
EX_PB8: length 14.6
  Top Layer w0.152: 9.27,36.48 9.27,35.71 10.29,34.7 11.43,34.7 12.45,33.68 15.37,33.68 16.33,32.72 STM32F405.61
EX_SPI3_MISO: length 12.9
  Top Layer w0.152: 12.67,36.48 12.67,35.62 13.84,34.44 15.62,34.44 17.02,33.05 17.02,31.4 18.03,30.39 18.03,28.86 18.83,28.06 STM32F405.56
EX_SPI3_MOSI: length 14
  Top Layer w0.152: 10.97,36.48 10.97,35.67 12.57,34.06 15.49,34.06 16.67,32.89 16.67,31.24 17.65,30.25 17.65,28.71 18.33,28.03 STM32F405.57
EX_SPI3_SCK: length 11.6
  Top Layer w0.152: STM32F405.55 19.33,28.08 18.41,29 18.41,30.51 17.4,31.52 17.4,33.17 15.75,34.83 15.24,34.83 14.37,35.69 14.37,36.48
EX_UART5_RX: length 10.8
  Top Layer w0.152: STM32F405.54 19.83,28.07 18.8,29.11 18.8,30.63 17.78,31.65 17.78,33.3 16.27,34.81 16.27,36.28 16.07,36.48
EX_UART5_TX: length 10.3
  Top Layer w0.152: 17.77,36.48 17.78,36.47 17.78,33.81 18.16,33.43 18.16,31.78 19.18,30.76 19.18,29.24 20.33,28.08 STM32F405.53
GPIO_EXTI2: length 17.2
  Top Layer w0.152: v3(14.72,20.82) 14.65,20.75 STM32F405.10 ; R37.1 9.26,9.55 9.29,9.52 v1(9.95,9.52)
  Bottom Layer w0.127: v1(9.95,9.52) 9.95,10.26 9.65,10.56 9.65,16.28 10.67,17.3 11.68,17.3 13.16,18.78 ATGM336H.4
  Bottom Layer w0.152: ATGM336H.4 13.16,20.05 13.93,20.82 v3(14.72,20.82)
GPIO_EXTI5: length 8.7
  Top Layer w0.152: ICM42.4 19.68,10.05 19.41,10.32 ; 19.34,10.41 19.35,10.39 ; 19.41,10.32 19.39,10.35 ; 19.41,10.32 19.25,10.49 19.25,10.72 ; 18.95,14.8 18.97,14.78 ; STM32F405.25 18.83,15.13 ; 18.83,15.13 18.83,14.92 18.97,14.78 ; 18.83,15.13 18.83,15.1 18.83,15.09 ; 19.3,10.48 19.31,10.46 ; 19.25,10.72 19.25,10.68 ; 19.25,10.72 v1(19.25,12.41) ; 18.97,14.78 v1(19.12,14.63)
  Bottom Layer w0.152: v1(19.12,14.63) 18.54,14.63 17.91,14 17.91,12.73 18.37,12.26 19.1,12.26 v1(19.25,12.41)
GPIO_EXTI8: length 45.8
  Top Layer w0.127: v1(17.15,2.69) v1(27.05,2.69)
  Top Layer w0.152: R22.1 v1(9.91,8.66) ; v1(28.07,14.38) 28.07,14.5 27.84,14.73 27.84,17.27 27.03,18.09 26.52,18.09 25.78,18.82 25.78,20.86 24.89,21.75 STM32F405.41
  Bottom Layer w0.127: v1(9.91,8.66) 10.77,7.8 13.86,7.8 17.15,4.52 v1(17.15,2.69)
  Bottom Layer w0.152: v1(27.05,2.69) 27.05,13.62 27.81,14.38 v1(28.07,14.38) 30.16,14.38 30.46,14.67
GPIO_EXTI13: length 14
  Top Layer w0.152: S1.4 4.19,29.61 4.32,29.48 4.32,28.86 4.78,28.39 C27.1 4.79,28.34 5.81,28.34 5.99,28.52 11.13,28.52 13.9,25.75 13.9,25.09 13.56,24.75 STM32F405.2
GPIO_EXTI14: length 18.4
  Top Layer w0.152: v1(5.47,21.36) 5.47,22.75 v1(5.46,22.76) ; v1(13.84,24.27) 13.81,24.24 12.89,24.24 STM32F405.3
  Bottom Layer w0.152: v1(5.47,21.36) 6.6,21.36 6.99,20.98 11.68,20.98 12.57,21.87 12.57,22.89 13.84,24.16 v1(13.84,24.27) ; v1(5.46,22.76) 4.32,22.76 3.34,23.73 3.34,23.85 ; S2.4 3.44,26.21 3.44,23.95 C28.1
GPS_RX: length 1.6
  Top Layer w0.152: STM32F405.14 13.53,18.75 14.12,19.33 14.22,19.33
  vias: v1(14.22,19.31)
GPS_TX: length 2.8
  Top Layer w0.152: STM32F405.15 12.91,18.23 14.15,18.23 v1(15.24,19.31)
I2C1_SCL: length 32.9
  Top Layer w0.152: R5.1 17.47,8.73 17.46,8.74 v1(17.46,9.41) 17.46,9.95 QMC.1 ; STM32F405.58 17.84,27.19 17.84,25.62 v1(17.53,25.3) ; v1(17.17,6.55) 15.06,4.44 11.52,4.44 9.41,2.34 9.41,1.59
  Bottom Layer w0.152: v1(17.17,6.55) 17.17,9.11 v1(17.46,9.41) 17.53,9.48 17.53,18.06 17.87,18.4 17.87,22.67 17.53,23.01 v1(17.53,25.3)
I2C1_SDA: length 33
  Top Layer w0.152: v1(17.17,5.76) 17.17,5 16.26,4.09 12.95,4.09 11.11,2.25 11.11,1.59 ; R1.1 16.84,9.01 QMC.16 16.84,9.86 16.6,10.11 v1(16.6,10.27) ; v1(17.02,25.94) 17.02,26.04 17.33,26.35 STM32F405.59
  Bottom Layer w0.152: v1(17.17,5.76) 16.6,6.33 v1(16.6,10.27) 17.15,10.82 17.15,18.19 17.56,18.6 17.56,22.47 17.02,23.01 v1(17.02,25.94)
I2C2_SCL: length 38.4
  Top Layer w0.152: v1(22.97,4.08) 22.48,3.58 17.53,3.58 17.37,3.74 14.25,3.74 12.81,2.3 12.81,1.59 ; STM32F405.29 20.83,15.81 20.83,16.66 21.46,17.3 23.37,17.3 23.75,16.92 23.75,15.94 v1(23.88,15.81) 23.95,15.73 ICP.4 25.07,15.88 25.07,16.67 R11.1
  Bottom Layer w0.152: v1(23.88,15.81) 23.29,15.22 23.29,11.83 22.53,11.07 19.29,11.07 18.6,10.39 18.6,5.96 19.4,5.17 21.53,5.17 22.62,4.08 v1(22.97,4.08)
I2C2_SDA: length 38.6
  Top Layer w0.152: STM32F405.30 21.33,16.66 21.64,16.97 22.68,16.97 23.37,16.28 23.37,15.52 v1(23.88,15.01) 23.95,15.08 ICP.3 25.1,15.08 25.65,15.64 25.65,16.33 R10.1 ; 14.51,1.59 14.51,2.47 15.43,3.39 17.21,3.39 17.37,3.23 23.38,3.23 v1(24.23,4.08)
  Bottom Layer w0.152: v1(24.23,4.08) 22.82,5.49 19.56,5.49 18.92,6.12 18.92,10.24 19.43,10.74 22.68,10.74 23.88,11.94 v1(23.88,15.01)
ICM42688P_CS: length 6.4
  Top Layer w0.152: STM32F405.24 18.33,14.46 18.67,14.12 19.69,14.12 20.32,13.49 20.96,13.49 21.77,12.68 ICM42.12
ICM42688P_SCK: length 7.4
  Top Layer w0.152: ICM42.13 21.27,11.98 21.25,11.99 21.25,12.56 20.84,12.96 v1(20.7,12.96) ; STM32F405.21 16.83,14.44 18.41,12.85 v1(18.56,12.85)
  Bottom Layer w0.152: v1(20.7,12.96) 18.67,12.96 v1(18.56,12.85)
ICM42688P_SDI: length 5.8
  Top Layer w0.152: STM32F405.23 17.83,14.45 18.54,13.74 19.56,13.74 20.16,13.14 20.16,12.49 20.77,11.88 ICM42.14
ICM42688P_SDO: length 6.1
  Top Layer w0.152: STM32F405.22 17.33,14.45 18.41,13.36 19.43,13.36 19.81,12.98 19.81,11.55 ICM42.1
LED_ERR: length 24
  Top Layer w0.127: ERR.1 7.08,7.77 10.92,7.77 11.76,8.61 11.76,12.59 12.95,13.79 12.95,15.16 13.45,15.65 13.97,15.65 14.34,16.02 14.34,16.71 16.37,18.74 16.37,20.49 15.1,21.75 STM32F405.8
LED_LF: length 17.9
  Top Layer w0.152: STM32F405.62 15.83,32.71 15.24,33.3 12.32,33.3 11.27,34.35 10.11,34.35 9.68,34.78 9.06,34.78 7.19,36.65 5.92,36.65 5.46,37.11 5.46,37.3
LED_LR: length 29.8
  Top Layer w0.127: 5.46,0.7 5.46,0.79 6.86,2.19 6.86,5.11 5.84,6.12 5.84,7.52 6.35,8.03 10.79,8.03 11.49,8.73 11.49,12.74 12.7,13.94 12.7,15.96 15.75,19.01 15.75,19.71 15.21,20.25 STM32F405.11
LED_RF: length 18.9
  Top Layer w0.127: RF#2.2 32.57,37.3 29.21,33.94 29.21,28.47 28.7,27.97 23.5,27.97 23.2,28.27 22.21,28.27 21.83,27.88 STM32F405.50
LED_RR: length 24.6
  Top Layer w0.127: STM32F405.33 26.94,17.75 27.56,17.13 27.56,12.94 v1(27.62,12.88)
  Top Layer w0.152: 32.54,0.7 32.54,0.83 32,1.37 v1(32,1.4)
  Bottom Layer w0.127: v1(32,1.4) 31.65,1.04 28.96,1.04 27.69,2.31 27.69,3.03 27.43,3.28 27.43,11.97 27.69,12.22 27.69,12.81 v1(27.62,12.88)
LED_SENS: length 26.2
  Top Layer w0.127: v4(10.16,11.2) 7.11,11.2 6.35,10.44 6.32,10.44
  Top Layer w0.152: STM32F405.4 13.78,23.75 14.42,23.12 v1(14.99,23.12)
  Bottom Layer w0.127: v1(14.99,23.12) 16.41,23.12 17.27,22.25 17.27,18.82 16.75,18.31 13.07,18.31 11.81,17.05 10.79,17.05 9.91,16.16 9.91,12.09 10.23,11.76 10.23,11.28 v4(10.16,11.2)
LORA_RST: length 19.8
  Top Layer w0.152: STM32F405.20 16.33,14.01 15.56,13.23 12.83,13.23 12.06,12.47 12.06,7.84 v1(12.65,7.25)
  Bottom Layer w0.152: v1(12.65,7.25) 12.65,3.47 11.86,2.67 11.46,2.67
  Bottom Layer w0.203: 11.46,2.67 11.31,2.53 9.58,2.53 RST-RF.4
LORA_RX: length 21.3
  Top Layer w0.152: STM32F405.16 12.68,17.75 v1(12.68,16.8)
  Bottom Layer w0.152: v1(12.68,16.8) 12.68,16.58 13.5,15.76 15.51,15.76 16.38,14.89 16.38,11.46 15.49,10.57 15.49,6.63 17.78,4.34 17.78,1.87 DX-LR01.21
LORA_TX: length 6.3
  Top Layer w0.152: v1(19.47,17.55) 18.73,16.8 15.18,16.8 14.83,16.45 STM32F405.17
  Bottom Layer w0.152: v1(19.47,17.55) 19.83,17.55 19.96,17.67
OSC_IN: length 6.8
  Top Layer w0.299: 9.37,26.96 9.37,25.51 X1.2 10.73,23.25 STM32F405.5
OSC_OUT: length 6.8
  Top Layer w0.299: STM32F405.6 10.71,22.75 X1.1 9.35,20.54 9.35,19.08
PC1: length 26.2
  Top Layer w0.152: STM32F405.9 14.24,21.25 14.39,21.41 14.94,21.41 16.06,20.29 16.06,18.88 13.82,16.64 v1(13.82,16.28) ; VL53L8CX.3 20.48,5.46 18.84,7.09 16.08,7.09 v1(16,7.01)
  Bottom Layer w0.152: v1(16,7.01) 16,10.57 16.76,11.33 16.76,15.01 15.5,16.28 v1(13.82,16.28)
RST: length 32.4
  Top Layer w0.152: v1(3.68,18.82) 3.84,18.82 RST.4 4.32,18.76 4.32,17.95 R8.1 4.78,17.48 C6.1 ; STM32F405.7 14.86,22.25 15.49,22.89 15.49,24.79 11.44,28.85 6.61,28.85 6.46,29 5.1,29 v1(5.09,29.01)
  Bottom Layer w0.152: v1(5.09,29.01) 6.39,27.72 6.39,22.92 5.69,22.23 5.12,22.23 3.56,20.67 3.56,18.95 v1(3.68,18.82)
SWCLK: length 12.1
  Top Layer w0.152: SWD.4 31.6,28.7 30.74,27.83 30.31,27.83 30.16,27.98 30.16,28.47 29.99,28.64 29.72,28.64 29.55,28.48 29.55,27.8 29.4,27.65 22.33,27.65 STM32F405.49
SWDIO: length 12.1
  Top Layer w0.152: SWD.3 31.78,27.45 30.95,26.62 30.35,26.62 30.06,26.91 24.47,26.91 23.28,25.72 23.28,24.5 23.53,24.25 STM32F405.46
TPS_EN: length 2.2
  Bottom Layer w0.254: TPS.5 R39.1 R32.2
TPS_VIN: length 9
  Bottom Layer w0.152: C24.1 28.83,31.52 32.51,31.52 33.66,30.38 33.66,29.48 32.24,28.07 32.03,28.07
USB_DEBUG_DM: length 12
  Top Layer w0.203: DBG.B7 28.94,16.68 arc(28.59,16.82) 28.45,17.17 28.45,17.67 arc(28.45,17.68) 28.45,17.68 ; DBG.A7 28.45,17.68 ; 28.45,17.68 28.2,17.68 27.43,18.44 26.67,18.44 26.16,18.95 26.16,20.98 25.78,21.36 25.78,21.71 26.16,22.09 26.16,22.39 25.29,23.27 24.27,23.27 STM32F405.44
USB_DEBUG_DP: length 12
  Top Layer w0.203: DBG.A6 30.25,17.18 arc(30.59,17.32) 30.74,17.67 arc(30.59,18.03) 30.23,18.18 DBG.B6 28.33,18.18 26.54,19.97 26.54,22.63 25.42,23.75 STM32F405.45
$1N19: length 1.9
  Top Layer w0.249: QMC.10 14.25,11.05 13.46,11.84 C2.1
$1N83: length 1.4
  Top Layer w0.152: C16.2 25.43,24.75 STM32F405.47
$1N84: length 1.4
  Top Layer w0.152: STM32F405.31 21.83,14.49 21.76,14.42
$1N102: length 3.6
  Top Layer w0.152: STM32F405.28 20.33,16.67 21.45,17.79 v1(21.45,18.77)
  Bottom Layer w0.152: 21.63,18.77 v1(21.45,18.77)
$1N103: length 1.3
  Top Layer w0.152: STM32F405.60 R35.1
$1N118: length 2.2
  Bottom Layer w0.254: TPS.4 R13.1 R12.2
$1N121: length 1.5
  Bottom Layer w0.406: TPS.6 29.94,26.63 30.06,26.51
$1N122: length 5.1
  Bottom Layer w0.6: v3(25.91,28.96) v3(26.56,28.96) v3(27.21,28.96) v3(27.86,28.96) 28.28,28.96 28.84,28.39 28.84,27.56 28.64,27.35 C23.2
  vias: v3(21.86,29.23) v3(22.1,29.87) v3(22.5,29.23) v3(23.13,29.23) v3(23.77,29.23) v3(28.49,28.75)
$1N125: length 0.9
  Top Layer w0.254: 7.4,13.74 R15.2
$1N127: length 2.8
  Bottom Layer w0.355: R16.1 R14.2 26.61,21.17 TLV.5
$1N138: length 0.9
  Top Layer w0.254: 7.4,12.85 R17.1
$1N141: length 0.9
  Top Layer w0.254: 7.4,11.97 R18.2
$1N278: length 3.9
  Bottom Layer w0.6: TLV.4 28.51,23.08 arc(28.31,23.57) 27.81,23.78 27.31,23.78 arc(26.81,23.98) 26.61,24.47 TLV.1
$1N282: length 1.3
  Top Layer w0.299: DBG.A5 28.35,16.18
$1N283: length 1.3
  Top Layer w0.299: DBG.B5 R7.1
$1N318: length 0.9
  Top Layer w0.254: 7.4,8.66 R22.2
$1N356: length 6.4
  Top Layer w0.305: 35.57,11.14 35.44,11.27 33,11.27 BUZ.2 32.85,11.59 Q1.3
$1N367: length 0.9
  Top Layer w0.254: 7.4,9.55 R37.2
$1N378: length 4.9
  Bottom Layer w0.508: ATGM336H.6 10.97,18.78 9.99,17.81 8.89,17.81 8.12,17.03 C31.1
$1N384: length 2.3
  Bottom Layer w0.567: ATGM336H.11 8.76,31.42
$1N390: length 11.1
  Bottom Layer w0.152: ATGM336H.9 7.66,20.01 8.32,20.66 11.37,20.66 12.06,19.97 ATGM336H.5 12.06,18.12 11.55,17.6 10.59,17.6 10.16,17.17 9.73,17.17 9.1,16.54 R36.1
$1N391: length 5.8
  Bottom Layer w0.305: ATGM336H.8 8.76,18.9 8.03,18.17 6.58,18.17 C32.2 6.48,19.13 C30.2 6.22,19.39 6.22,20.54
$1N397: length 3.3
  Bottom Layer w0.567: 8.76,32.63 8.76,33.77 arc(9.11,34.6) 9.94,34.95 10.23,34.95
$1N445: length 0.9
  Top Layer w0.254: 7.4,10.44 R28.1
$1N446: length 0.9
  Top Layer w0.254: 7.4,7.14 R27.1
$1N450: length 0.8
  Top Layer w0.203: R26.1 LF.1
$1N451: length 0.8
  Top Layer w0.203: R25.1 LR.1
$1N452: length 0.8
  Top Layer w0.203: R24.1 RF#2.1
$1N453: length 0.8
  Top Layer w0.203: RR.1 R23.1

## Copper pours and planes (outline as drawn; the poured copper is in the pictures)
3V3 on Top Layer: 1.4,13.49 1.78,13.87 2.92,13.87 3.43,13.36 3.43,11.08 3.05,10.69 1.78,10.69 1.4,11.08
3V3 on Bottom Layer: 29.59,22.76 29.34,23.01 29.34,23.65 29.72,24.03 33.02,24.03 33.27,23.78 33.27,23.14 32.89,22.76
3V3 on Bottom Layer: 1.4,13.49 1.78,13.87 2.92,13.87 3.43,13.36 3.43,11.08 3.05,10.69 1.78,10.69 1.4,11.08
5V_TPS on Bottom Layer: 23.88,28.09 24,27.97 24,27.19 23.88,27.06 23.14,27.06 22.9,26.82 22.9,25.49 22.75,25.34 21.93,25.34 21.76,25.51 21.76,26.19 21.45,26.49 20.65,26.49 20.45,26.7 20.45,27.84 20.7,28.09
GND on Top Layer: -1.78,39.14 39.5,39.14 39.5,-1.62 -1.78,-1.62
GND on Bottom Layer: -1.65,39.14 39.5,39.14 39.5,-1.24 -1.65,-1.24
GND on Bottom Layer: 7.66,36.25 11.63,36.25 11.63,27.89 7.66,27.89
VIN on Top Layer: 26.11,32.14 26.11,33.82 25.68,34.22 24.36,34.22 24,34.57 24,35.51 24.36,35.87 27.02,35.87 27.43,35.46 27.43,34.49 26.89,33.94 26.89,32.14
VIN on Bottom Layer: 26.92,34.06 24.46,34.06 24,34.52 24,35.51 24.49,36 26.89,36 27.44,35.45 27.44,34.58
TPS_VIN on Bottom Layer: 28.32,29.49 25.79,29.49 25.65,29.63 25.65,30.76 24.76,31.65 24.76,32.9 25.55,33.68 29.46,33.68 29.46,30.63
$1N122 on Top Layer: 28.32,27.71 24.89,27.71 23.75,28.86 21.76,28.86 21.52,29.09 21.52,29.99 21.78,30.25 27.69,30.25 28.96,28.98 28.96,28.35
$1N122 on Bottom Layer: 23.88,30.25 24.13,30 24.13,29.11 23.88,28.86 21.72,28.86 21.53,29.04 21.53,29.94 21.84,30.25
$1N129 on Bottom Layer: 28.19,24.41 28.07,24.54 28.07,25.55 28.32,25.81 31.75,25.81 31.88,25.68 31.88,24.92 31.37,24.41
$1N278 on Bottom Layer: 25.99,26.62 27,25.6 27,23.65 26.29,23.65 25.78,23.14 25.78,22.63 25.4,22.25 24.13,22.25 24,22.38 24,23.35 24.67,24.02 24.67,24.63 25.18,25.14 25.18,26.21 25.59,26.62

Small or netless copper shapes (teardrops, artwork), in the pictures only: 225 on Top Layer, 113 on Bottom Layer

## Text on the board
Bottom Silkscreen Layer: 3V3 | GND | CUR | Designed by WilliTourt | MambaQuadFC | v1.1 | 260410
Top Silkscreen Layer: B8 | IIC1 | SPI3 | IIC2 | UART5 | INDICATORS | RGT6
